# EAGLE design Audio Amplifier Rev C2 (EAGLE 8.4.1)
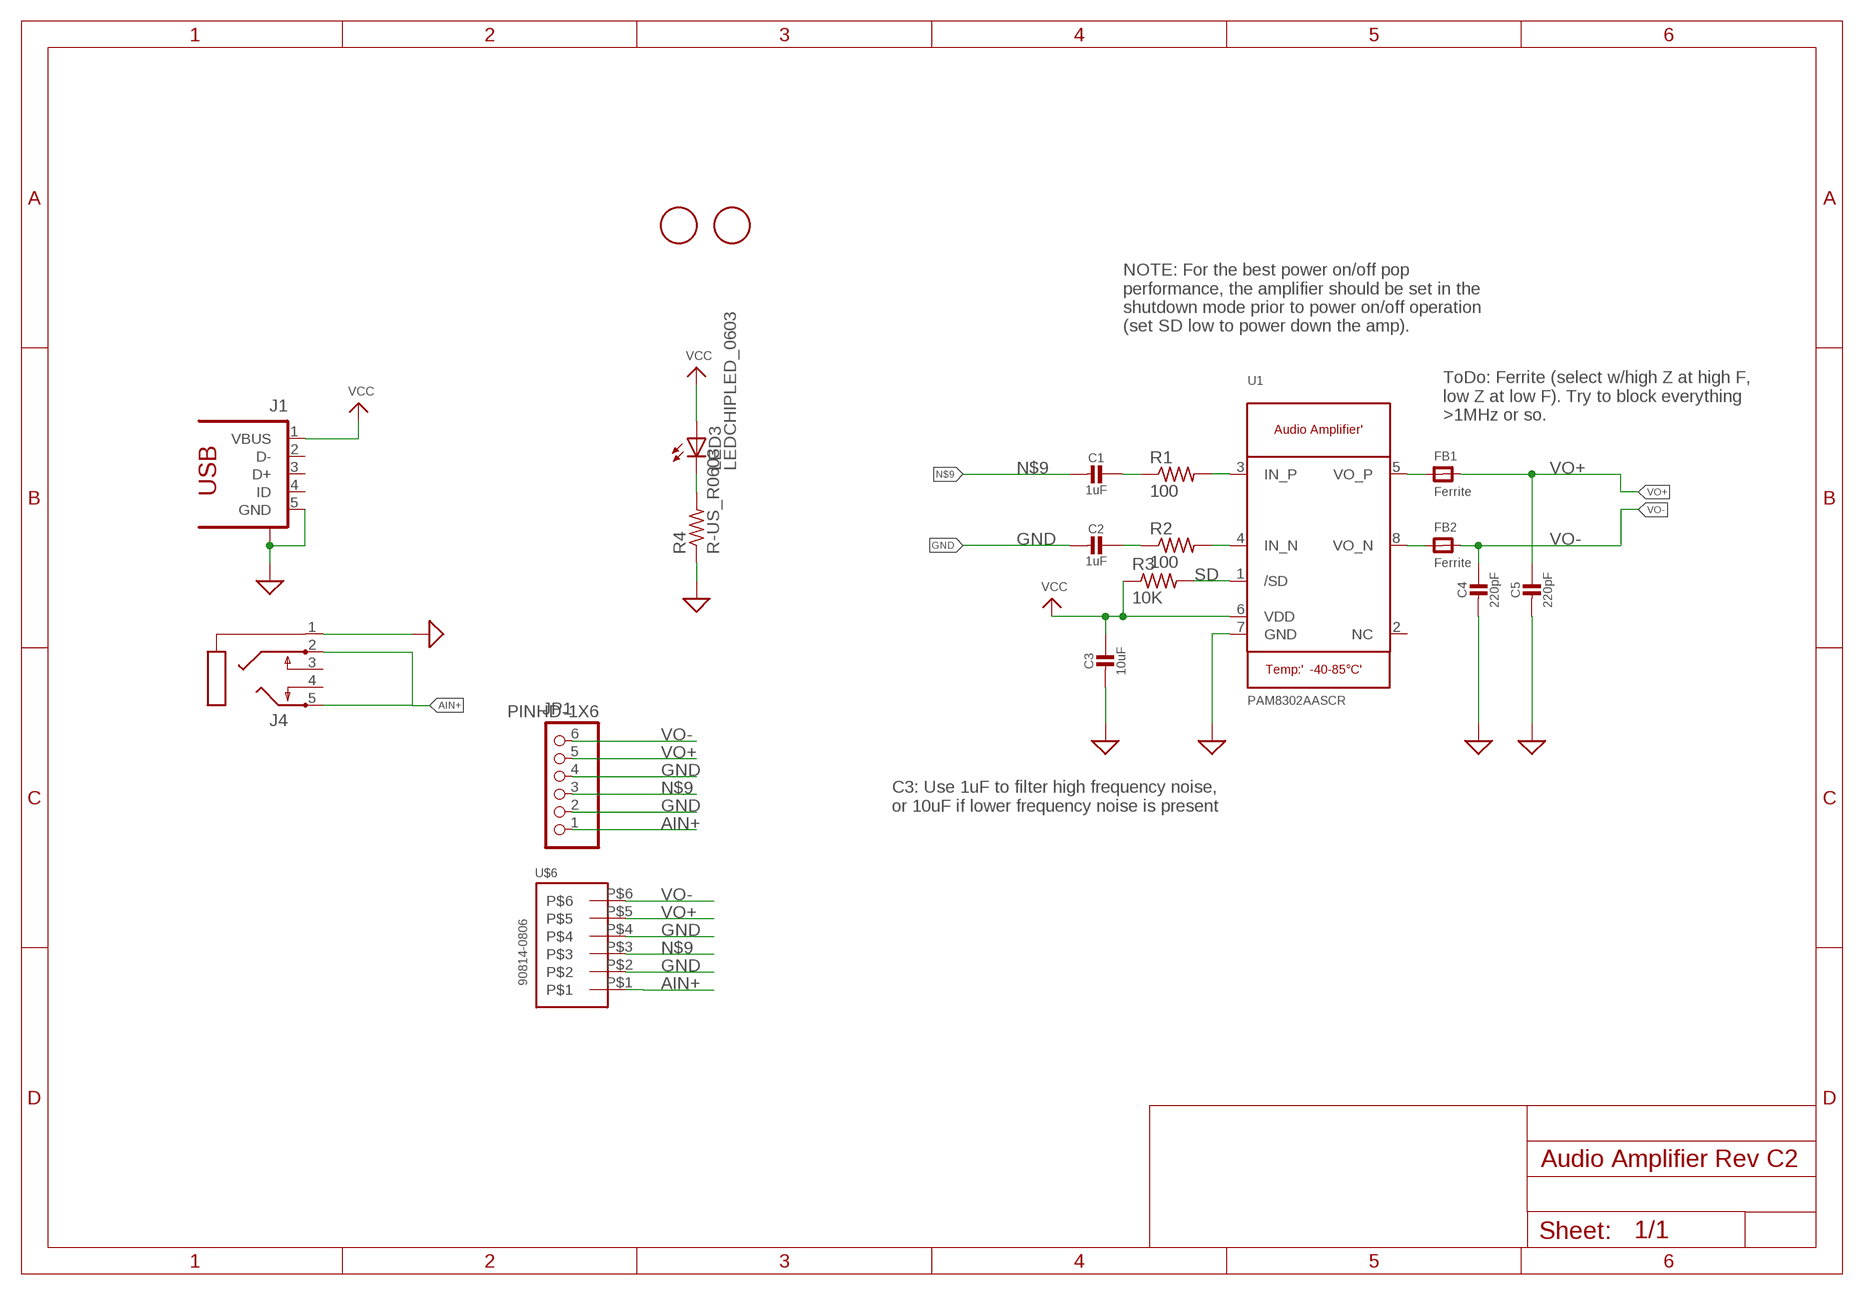
[diagram p0: schematic, sheet 1]

## Parts
C1  1uF  CAP_CERAMIC0805-NOOUTLINE  [0805-NO]
C2  1uF  CAP_CERAMIC0805-NOOUTLINE  [0805-NO]
C3  10uF  CAP_CERAMIC0805-NOOUTLINE  [0805-NO]
C4  220pF  CAP_CERAMIC0805-NOOUTLINE  [0805-NO]
C5  220pF  CAP_CERAMIC0805-NOOUTLINE  [0805-NO]
FB1  Ferrite  FERRITE_0805  [_0805]
FB2  Ferrite  FERRITE_0805  [_0805]
J1  1981584-1  [1981584-1]
J4  STEREOJACK  [STX3100]
JP1  PINHD-1X6  [1X06]
LED3  LEDCHIPLED_0603  [CHIPLED_0603]
R1  100  R-US_R0603  [R0603]
R2  100  R-US_R0603  [R0603]
R3  10K  R-US_R0603  [R0603]
R4  R-US_R0603  [R0603]
U1  PAM8302AASCR  AUDIOAMP_PAM8302A  [MSOP8_0.65MM]
U$3  FIDUCIAL  [FIDUCIAL_1MM]
U$4  FIDUCIAL  [FIDUCIAL_1MM]
U$6  90814-0806  [90814-0806]

## Nets
AIN+: J4.2 J4.5 JP1.1 U$6.P$1
GND: C2.2 C3.2 C4.2 C5.2 J1.5(GND) J1.S1 J4.1 JP1.2 JP1.4 R4.1 U1.7(GND) U$6.P$2 U$6.P$4 ; supply symbol labelled SUP
N$1: R2.2 U1.4(IN_N)
N$2: LED3.C R4.2
N$3: R1.2 U1.3(IN_P)
N$4: C2.1 R2.1
N$6: FB2.1 U1.8(VO_N)
N$7: FB1.1 U1.5(VO_P)
N$8: C1.1 R1.1
N$9: C1.2 JP1.3 U$6.P$3
SD: R3.2 U1.1(/SD)
VCC: C3.1 J1.1(VBUS) LED3.A R3.1 U1.6(VDD)
VO+: C5.1 FB1.2 JP1.5 U$6.P$5
VO-: C4.1 FB2.2 JP1.6 U$6.P$6
Unconnected: J1.2(D-) J1.3(D+) J1.4(ID) J4.3 J4.4 U1.2(NC)

## Notes on the sheet
- NOTE: For the best power on/off pop
  performance, the amplifier should be set in the
  shutdown mode prior to power on/off operation
  (set SD low to power down the amp).
- ToDo: Ferrite (select w/high Z at high F,
  low Z at low F). Try to block everything
  >1MHz or so.
- C3: Use 1uF to filter high frequency noise,
  or 10uF if lower frequency noise is present

## Library data of the parts
C1-C5 = audio amplifier example:CAP_CERAMIC
FB1 FB2 = audio amplifier example:FERRITE
J1 = audio amplifier example:1981584-1: Receptacle, micro-USB, type A/B Tyco Electronics
J4 = audio amplifier example:STEREOJACK: MIC/HEADPHONE JACK Stereo jack with two switches. Kycon STX3100, CUI SJ1-3555NG and/or 4UCon 05544
JP1 = audio amplifier example:PINHD-1X6: PIN HEADER
LED3 = audio amplifier example:LED
R1-R4 = audio amplifier example:R-US_: RESISTOR, American symbol
U1 = audio amplifier example:AUDIOAMP_PAM8302A: PAM8302A - 2.5W Class-D Mono Audio Amplifier MSOP8 = PAM8302AASCR
U$3 U$4 = Audio Amplifier Rev C1:FIDUCIAL: For use by pick and place machines to calibrate the vision/machine, 1mm By microbuilder.eu
U$6 = audio amplifier example:90814-0806

## Board
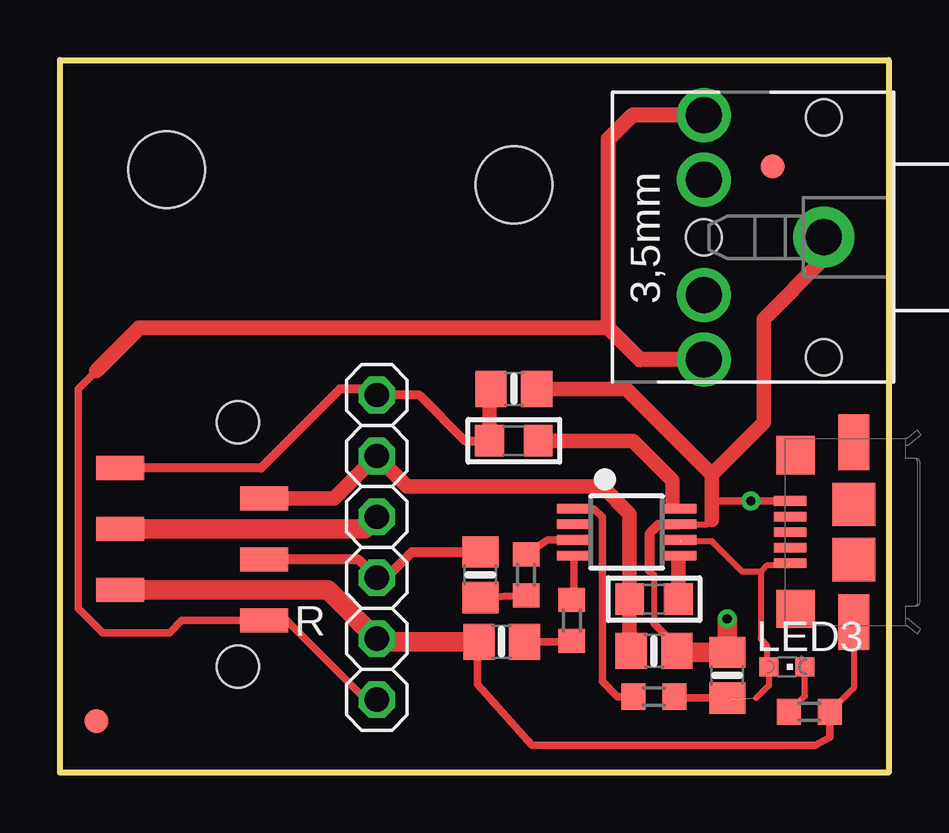
[diagram p1: board, top side]
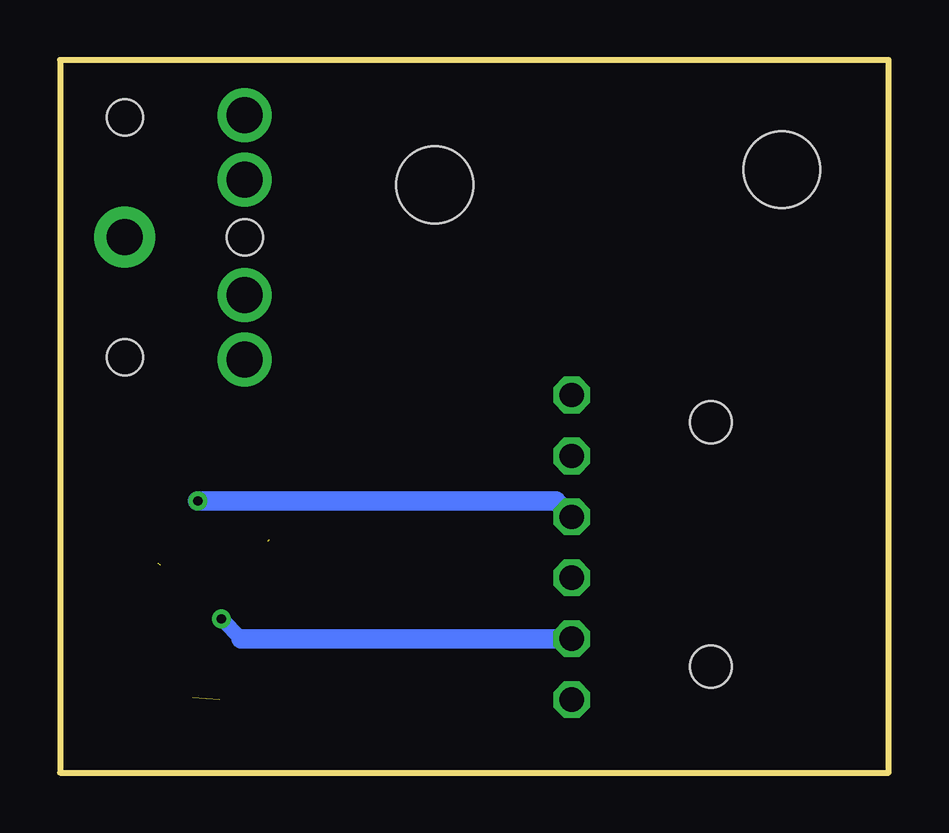
[diagram p2: board, bottom side, seen from below]

Size 34.54 x 29.72 mm. Coordinates in mm from the lower left corner, seen from the top.
Outline: 34.54,0 34.54,28.57
Outline: 34.54,0 0,0 0,11.94 0,29.72 34.54,29.72 34.54,0
Copper layers (1*16): Top 0.035mm / dielectric 1.5mm / Bottom 0.035mm
Design rules "default *": minimum track width 6mil, minimum drill 0.35mm, track to track 10mil, track to pad 10mil, pad to pad 10mil, via to via 10mil, smd to smd 6mil, copper to edge 10mil, drill to drill 6mil, minimum pad ring 10mil, minimum via ring 8mil, stop-mask expansion 4mil, vias tented up to drill 1mm, thermal gap 10mil
Holes 3.2 mm at 18.92,24.51 4.45,25.15

### Footprints (pad centres in the part's own frame; a part is rotated, then mirrored left to right if it is on the bottom)
0805-NO = smd 1.3 x 1.5: 1 -0.95,0; 2 0.95,0
_0805 = smd 1.2 x 1.3: 1 -1.016,0; 2 1.016,0
1981584-1 = smd 0.4 x 1.35: 1 -1.3,4.1; 2 -0.65,4.1; 3 0,4.1; 4 0.65,4.1; 5 1.3,4.1 | smd 1.8 x 1.8: M1 -1.15,1.45; M2 1.15,1.45 | smd 2.3 x 1.3: S1 -3.75,1.45; S2 3.75,1.45 | smd 1.6 x 1.6: S3 -3.2,3.885; S4 3.2,3.885
STX3100 = drill 1.5 pad 2.54: 1 2.7,-0.1 | drill 1.5: 2 7.7,5; 3 7.7,2.3; 4 7.7,-2.5; 5 7.7,-5.2 | hole 1.5: 2.7,4.9; 2.7,-5.1; 7.7,-0.1
1X06 = drill 1.016 octagon: 1 -6.35,0; 2 -3.81,0; 3 -1.27,0; 4 1.27,0; 5 3.81,0; 6 6.35,0
CHIPLED_0603 = smd 0.8 x 0.8: A 0,-0.75; C 0,0.75
R0603 = smd 1 x 1.1: 1 -0.85,0; 2 0.85,0
MSOP8_0.65MM = smd 0.4 x 1.4: 1 -0.975,-2.2; 2 -0.325,-2.2; 3 0.325,-2.2; 4 0.975,-2.2; 5 0.975,2.2; 6 0.325,2.2; 7 -0.325,2.2; 8 -0.975,2.2
FIDUCIAL_1MM = smd 1 x 1: 1 0,0
90814-0806 = smd 1 x 2: P$1 0,0; P$2 1.27,5.999; P$3 2.54,0; P$4 3.81,5.999; P$5 5.08,0; P$6 6.35,5.999 | hole 1.75: -1.93,1.1; 8.27,1.1

### Placement (x,y rotation side)
C1  17.53,8.26 90 top
C2  18.41,5.46 180 top
C3  27.81,4.06 90 top
C4  18.92,16 0 top
C5  24.76,5.08 0 top
FB1  24.76,7.24 180 top
FB2  18.92,13.84 180 top
J1  34.54,10.03 90 top
J4  34.54,22.22 180 top
JP1  13.21,9.4 90 top
LED3  30.3,4.42 270 top
R1  19.43,8.26 90 top
R2  21.34,6.35 90 top
R3  24.76,3.17 180 top
R4  31.24,2.54 180 top
U1  23.62,10.03 270 top
U$3  29.72,25.27 0 top
U$4  1.52,2.16 0 top
U$6  8.51,6.35 90 top

### Tracks (layer width: path | path; a pad name or v marks a point on that pad's centre or on a via)
AIN+
  Top 0.305: 1.52,16.76 0.76,16 0.76,6.86 1.78,5.84 4.57,5.84 5.08,6.35 8.38,6.35 U$6.P$1 9.46,6.35 | JP1.1 12.76,3.05 11.49,4.32 9.56,6.26 | 9.56,6.26 9.46,6.35 | 9.46,6.35 9.56,6.26
  Top 0.635: J4.2 24.18,17.22 22.86,18.54 | 22.86,18.54 22.86,26.42 23.88,27.43 J4.5 | 22.86,18.54 3.3,18.54 1.52,16.76
GND  (via drill 0.38)
  Top 0.254: 24.95,10.35 25.08,10.35 25.09,10.36 | 24.57,8.45 24.76,8.26 24.76,6.22 | U1.7 26.99,10.36 27.18,10.54 | J1.S1 33.09,3.54 R4.1
  Top 0.305: 25.46,5.53 C5.2 25.59,5.4 24.76,6.22 | R4.1 32.09,1.49 31.5,1.14 19.68,1.14 17.4,3.68 17.4,5.39 | 30.47,11.3 J1.5 v28.79,11.33 27.27,11.33 27.18,11.43
  Top 0.406: C3.2 27.75,5.08 27.81,5.15 | 13.34,5.46 JP1.2 | 33.09,6.66 J1.S1 33.09,6.4 | 17.4,5.39 C2.2 | 25.09,10.36 U1.7 | C5.2 25.78,5.01 | 24.95,10.35 24.57,9.97 24.57,8.45
  Top 0.61: 27.18,12.45 27.18,11.43 27.18,10.54 | 27.18,12.45 23.62,16 C4.2 | J4.1 31.84,21.43 29.34,18.92 29.34,14.61 27.18,12.45
  Top 0.813: JP1.2 11.18,7.62 U$6.P$2 | C2.2 13.34,5.46 | U$6.P$4 12.7,10.16 JP1.4 | 27.81,5.15 v27.81,6.41 | 25.78,5.01 C3.2
  Bottom 0.61: v27.81,6.41 26.99,5.59
  Bottom 0.813: v28.79,11.33 13.87,11.33 JP1.4 | 26.99,5.59 JP1.2
N$1
  Top 0.305: U1.4 21.42,7.77 R2.2
N$2
  Top 0.254: R4.2 31.05,3.2 LED3.C
N$3
  Top 0.305: U1.3 20.32,9.71 R1.2
N$4
  Top 0.305: C2.1 21.27,5.46 R2.1
N$6
  Top 0.254: U1.8 25.53,11.3
  Top 0.61: 25.53,11.3 25.53,12.19 23.88,13.84 FB2.1
N$7
  Top 0.254: 25.78,9.02 25.78,8.89
  Top 0.305: 25.78,9.02 U1.5
  Top 0.61: 25.78,8.89 FB1.1
N$8
  Top 0.305: R1.1 C1.1
N$9
  Top 0.406: C1.2 14.67,9.21 13.59,8.13 JP1.3 12.45,8.89 U$6.P$3
SD
  Top 0.305: R3.2 23.24,3.17 22.61,3.81 22.61,10.67 22.27,11.01 U1.1
VCC  (3 unrouted)
  Top 0.254: 29.55,4.32 29.55,3.64 29.02,3.11 | 29.55,4.32 LED3.A | 30.35,8.64 29.46,8.64 29.21,8.38 | 29.55,4.32 29.46,4.41 29.46,5.33 29.21,5.59 29.21,8.38 | 29.21,8.38 28.45,8.38 27.18,9.65 25.88,9.65
  Top 0.305: C3.1 25.78,3.11
  Top 0.406: 27.88,3.05 C3.1 | 25.78,3.11 R3.1 25.78,3.11
VO+
  Top 0.305: C5.1 23.75,5.15
  Top 0.61: 23.75,5.15 FB1.2 23.75,10.79 22.61,11.94 14.48,11.94 JP1.5 11.43,11.43 U$6.P$5
VO-
  Top 0.381: FB2.2 16.89,13.84 14.99,15.75 JP1.6 12.95,16 11.68,16 8.38,12.7 U$6.P$6
  Top 0.61: FB2.2 17.91,15.94 C4.1

### Text on the board
tPlace: R